# EAGLE design rc-light-controller-tlc5940 (EAGLE 5.12)
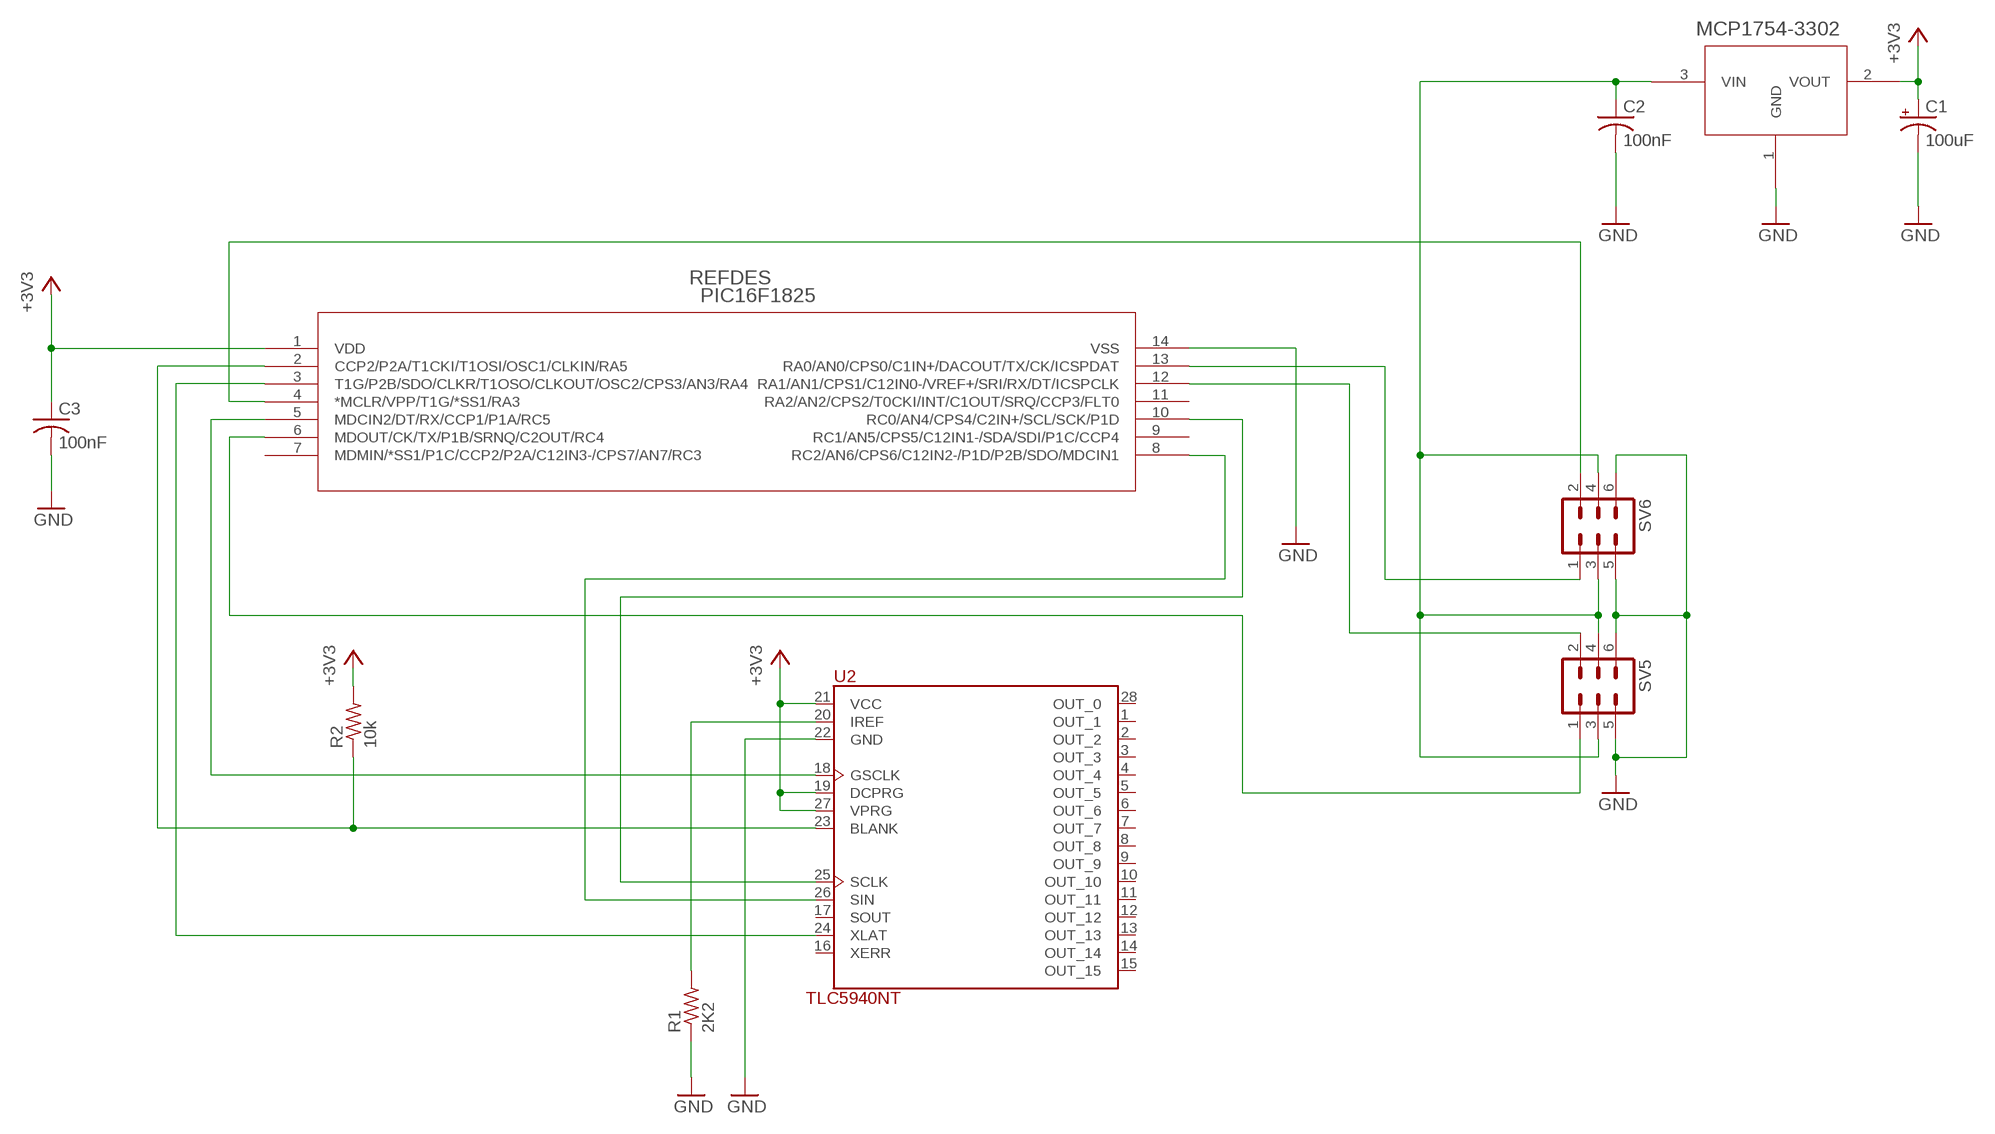
[diagram p0: schematic, sheet 1]

## Parts
C1  100uF  CPOL-USE3.5-8  [E3,5-8]
C2  100nF  C-USC0805K  [C0805K]
C3  100nF  C-USC0805K  [C0805K]
R1  2K2  R-US_0204/7  [0204/7]
R2  10k  R-US_0207/10  [0207/10]
SV5  MA03-2  [MA03-2]
SV6  MA03-2  [MA03-2]
U1  PIC16F1825-X_P  [PDIP14_300MC]
U2  TLC5940NT  [DIP-28]
U$1  MCP1754X-XXXXX/C  [SOT-23A_MC]

## Nets
+3V3: C1.+ C3.1 R2.2 U1.1(VDD) U2.19(DCPRG) U2.21(VCC) U2.27(VPRG) U$1.2(VOUT)
BLANK: R2.1 U1.2(CCP2/P2A/T1CKI/T1OSI/OSC1/CLKIN/RA5) U2.23(BLANK)
CH3: SV6.2 U1.4(*MCLR/VPP/T1G/*SS1/RA3)
GND: C1.- C2.2 C3.2 R1.1 SV5.5 SV5.6 SV6.5 SV6.6 U1.14(VSS) U2.22(GND) U$1.1(GND)
GSCLK: U1.5(MDCIN2/DT/RX/CCP1/P1A/RC5) U2.18(GSCLK)
IREF: R1.2 U2.20(IREF)
SCLK: U1.10(RC0/AN4/CPS4/C2IN+/SCL/SCK/P1D) U2.25(SCLK)
SIN: U1.8(RC2/AN6/CPS6/C12IN2-/P1D/P2B/SDO/MDCIN1) U2.26(SIN)
SLAT: U1.3(T1G/P2B/SDO/CLKR/T1OSO/CLKOUT/OSC2/CPS3/AN3/RA4) U2.24(XLAT)
SLAVEOUT: SV5.1 U1.6(MDOUT/CK/TX/P1B/SRNQ/C2OUT/RC4)
ST: SV5.2 U1.12(RA1/AN1/CPS1/C12IN0-/VREF+/SRI/RX/DT/ICSPCLK)
TH: SV6.1 U1.13(RA0/AN0/CPS0/C1IN+/DACOUT/TX/CK/ICSPDAT)
VIN: C2.1 SV5.3 SV5.4 SV6.3 SV6.4 U$1.3(VIN)
Unconnected: U1.7(MDMIN/*SS1/P1C/CCP2/P2A/C12IN3-/CPS7/AN7/RC3) U1.9(RC1/AN5/CPS5/C12IN1-/SDA/SDI/P1C/CCP4) U1.11(RA2/AN2/CPS2/T0CKI/INT/C1OUT/SRQ/CCP3/FLT0) U2.1(OUT_1) U2.2(OUT_2) U2.3(OUT_3) U2.4(OUT_4) U2.5(OUT_5) U2.6(OUT_6) U2.7(OUT_7) U2.8(OUT_8) U2.9(OUT_9) U2.10(OUT_10) U2.11(OUT_11) U2.12(OUT_12) U2.13(OUT_13) U2.14(OUT_14) U2.15(OUT_15) U2.16(XERR) U2.17(SOUT) U2.28(OUT_0)

## Library data of the parts
C1 = rcl:CPOL-US: POLARIZED CAPACITOR, American symbol
C2 C3 = resistor:C-US: CAPACITOR, American symbol
R1 R2 = rcl:R-US_: RESISTOR, American symbol
SV5 SV6 = con-lstb:MA03-2: PIN HEADER; OC_FARNELL: unknown; OC_NEWARK: unknown
U1 = PIC16F1825:PIC16F1825-X_P
U2 = tlc5940:TLC5940
U$1 = MCP1754:MCP1754X-XXXXX/C

## Net classes
0 default: width 0.254 mm, drill 0.508 mm, clearance 0.254 mm

## Board
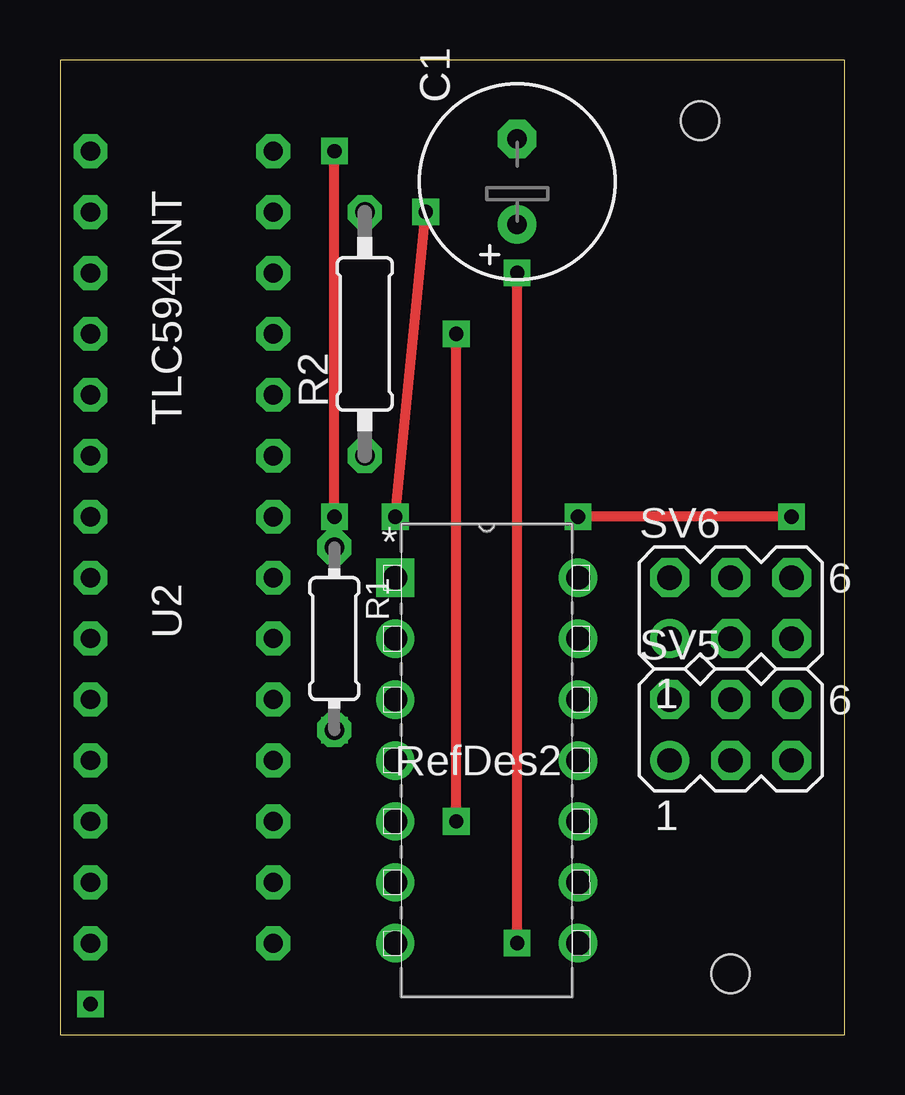
[diagram p1: board, top side]
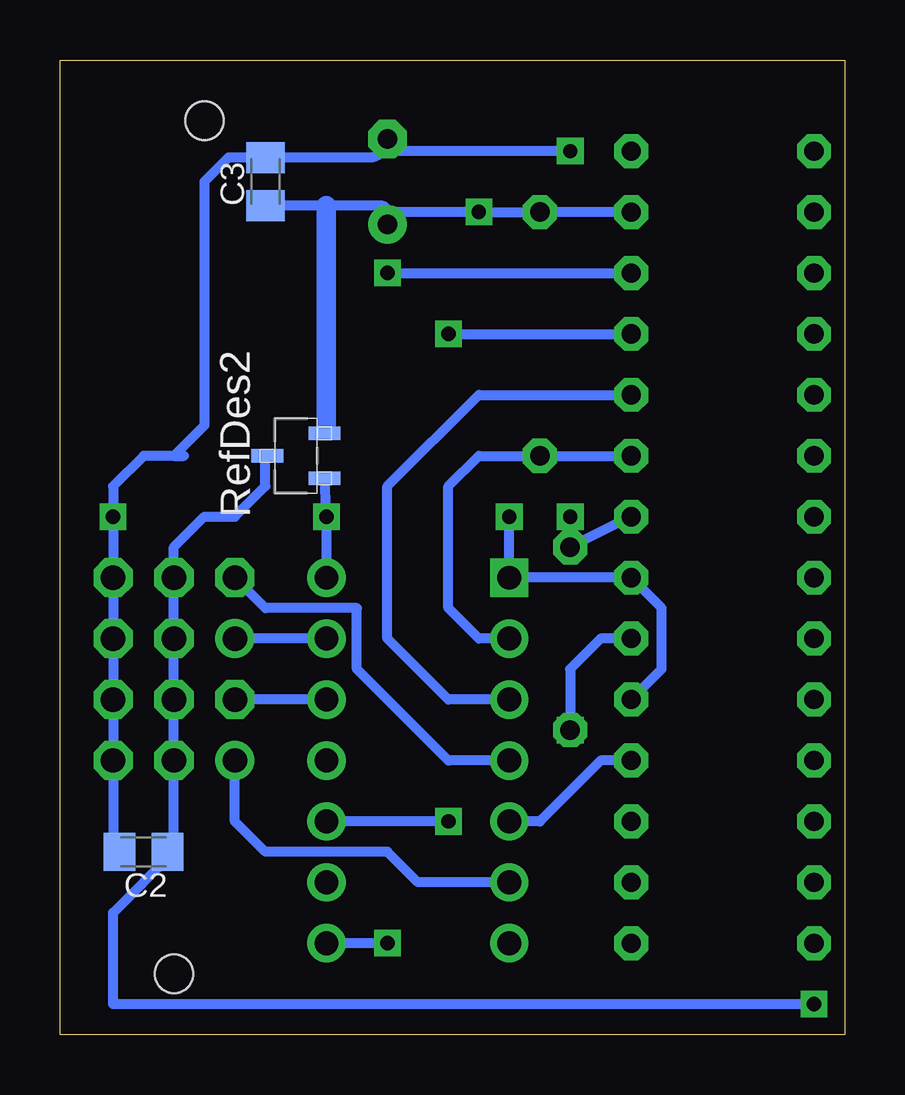
[diagram p2: board, bottom side, seen from below]

Size 32.69 x 40.63 mm. Coordinates in mm from the lower left corner, seen from the top.
Outline: 0,0 32.69,0 32.69,40.63 0,40.63 0,0
Copper layers (1*16): Top 0.035mm / dielectric 1.5mm / Bottom 0.035mm
Design rules "SparkFun": minimum track width 8mil, minimum drill 20mil, track to track 8mil, track to pad 8mil, pad to pad 8mil, via to via 8mil, smd to smd 8mil, copper to edge 10mil, drill to drill 8mil, minimum pad ring 12mil, minimum via ring 10mil, stop-mask expansion 4mil, vias tented up to drill 25mil, thermal gap 10mil
Holes 1.6 mm at 27.94,2.54 26.67,38.1

### Footprints (pad centres in the part's own frame; a part is rotated, then mirrored left to right if it is on the bottom)
E3,5-8 = drill 0.813 pad 1.6 round: + -1.778,0 | drill 0.813 pad 1.6 octagon: - 1.778,0
C0805K = smd 1.3 x 1.6: 1 -1,0; 2 1,0
0204/7 = drill 0.813 octagon: 1 -3.81,0; 2 3.81,0
0207/10 = drill 0.813 octagon: 1 -5.08,0; 2 5.08,0
MA03-2 = drill 1.016 round: 1 -2.54,-1.27 | drill 1.016 octagon: 2 -2.54,1.27; 3 0,-1.27; 4 0,1.27; 5 2.54,-1.27; 6 2.54,1.27
PDIP14_300MC = drill 0.991 square: 1 -7.62,15.24 | drill 0.991 round: 2 -7.62,12.7; 3 -7.62,10.16; 4 -7.62,7.62; 5 -7.62,5.08; 6 -7.62,2.54; 7 -7.62,0; 8 0,0; 9 0,2.54; 10 0,5.08; 11 0,7.62; 12 0,10.16; 13 0,12.7; 14 0,15.24
DIP-28 = drill 0.8 octagon: 1 -3.81,-1.27; 2 -3.81,-3.81; 3 -3.81,-6.35; 4 -3.81,-8.89; 5 -3.81,-11.43; 6 -3.81,-13.97; 7 -3.81,-16.51; 8 -3.81,-19.05; 9 -3.81,-21.59; 10 -3.81,-24.13; 11 -3.81,-26.67; 12 -3.81,-29.21; 13 -3.81,-31.75; 14 -3.81,-34.29; 15 3.81,-34.29; 16 3.81,-31.75; 17 3.81,-29.21; 18 3.81,-26.67; 19 3.81,-24.13; 20 3.81,-21.59; 21 3.81,-19.05; 22 3.81,-16.51; 23 3.81,-13.97; 24 3.81,-11.43; 25 3.81,-8.89; 26 3.81,-6.35; 27 3.81,-3.81; 28 3.81,-1.27
SOT-23A_MC = smd 0.559 x 1.321: 1 -0.94,-1.194; 2 0.94,-1.194; 3 0,1.194

### Placement (x,y rotation side)
C1  19.05,35.56 90 top
C2  29.21,7.62 180 bottom
C3  24.13,35.56 90 bottom
R1  11.43,16.51 270 top
R2  12.7,29.21 90 top
SV5  27.94,12.7 0 top
SV6  27.94,17.78 0 top
U1  21.59,3.81 0 top
U2  5.08,38.1 0 top
U$1  22.86,24.13 90 bottom

### Tracks (layer width: path | path; a pad name or v marks a point on that pad's centre or on a via)
+3V3  (via drill 0.6)
  Top 0.406: v13.97,21.59 v15.24,34.29
  Bottom 0.406: U2.19 7.62,15.24 7.62,17.78 U2.21 U1.1 v13.97,21.59 | 19.05,34.29 v15.24,34.29 R2.2 U2.27 | 19.05,34.29 C1.+ | 19.05,34.29 arc-90 19.32,34.56 21.59,34.56 C3.1 24.46,34.23 | U$1.2 21.67,25.32 21.59,25.4
  Bottom 0.813: 21.59,34.56 21.59,25.4
BLANK
  Bottom 0.406: U1.2 15.24,16.51 16.51,17.78 16.51,22.86 15.24,24.13 R2.1 U2.23
CH3
  Bottom 0.406: SV6.2 24.13,17.78 20.32,17.78 20.32,15.24 16.51,11.43 U1.4
GND  (via drill 0.6)
  Top 0.406: v30.48,21.59 v21.59,21.59 | v11.43,21.59 v11.43,36.83
  Bottom 0.406: SV5.5 30.21,11.43 | SV5.5 SV5.6 SV6.5 SV6.6 v30.48,21.59 30.48,22.86 29.21,24.13 27.94,24.13 | C2.2 30.48,7.62 SV5.5 | U1.14 v21.59,21.59 21.59,21.84 U$1.1 | 27.94,24.13 26.67,25.4 26.67,35.56 25.67,36.56 C3.2 19.83,36.56 arc-90 C1.- 18.54,36.83 v11.43,36.83 | 27.94,24.13 27.53,24.13 | U2.22 R1.1 v11.43,21.59
GSCLK
  Bottom 0.406: U2.18 10.16,11.43 12.7,8.89 U1.5
IREF  (via drill 0.6)
  Bottom 0.406: R1.2 11.43,15.24 10.16,16.51 U2.20
  other vias: 11.43,12.7
N$15  (via drill 0.6)
  other vias: 19.05,3.81
N$16  (via drill 0.6)
  other vias: 16.51,8.89
N$17  (via drill 0.6)
  other vias: 16.51,29.21
N$21  (via drill 0.6)
  other vias: 13.97,21.59
N$22  (via drill 0.6)
  other vias: 15.24,34.29
SCLK  (via drill 0.6)
  Top 0.406: v16.51,8.89 v16.51,29.21
  Bottom 0.406: v16.51,8.89 U1.10 | v16.51,29.21 U2.25
SIN  (via drill 0.6)
  Top 0.406: v19.05,3.81 v19.05,31.75
  Bottom 0.406: v19.05,3.81 U1.8 | v19.05,31.75 U2.26
SLAT
  Bottom 0.406: U2.24 15.24,26.67 19.05,22.86 19.05,16.51 16.51,13.97 U1.3
SLAVEOUT
  Bottom 0.406: SV5.1 25.4,8.89 24.13,7.62 19.05,7.62 17.78,6.35 U1.6
ST
  Bottom 0.406: U1.12 SV5.2
TH
  Bottom 0.406: U1.13 SV6.1
VIN  (via drill 0.6)
  Bottom 0.406: v1.27,1.27 30.48,1.27 30.48,5.08 27.94,7.62 | 27.94,7.62 C2.1 | 27.94,7.62 SV5.3 SV5.4 SV6.3 SV6.4 27.94,20.32 26.67,21.59 25.4,21.59 24.13,22.86 24.13,24.05 U$1.3